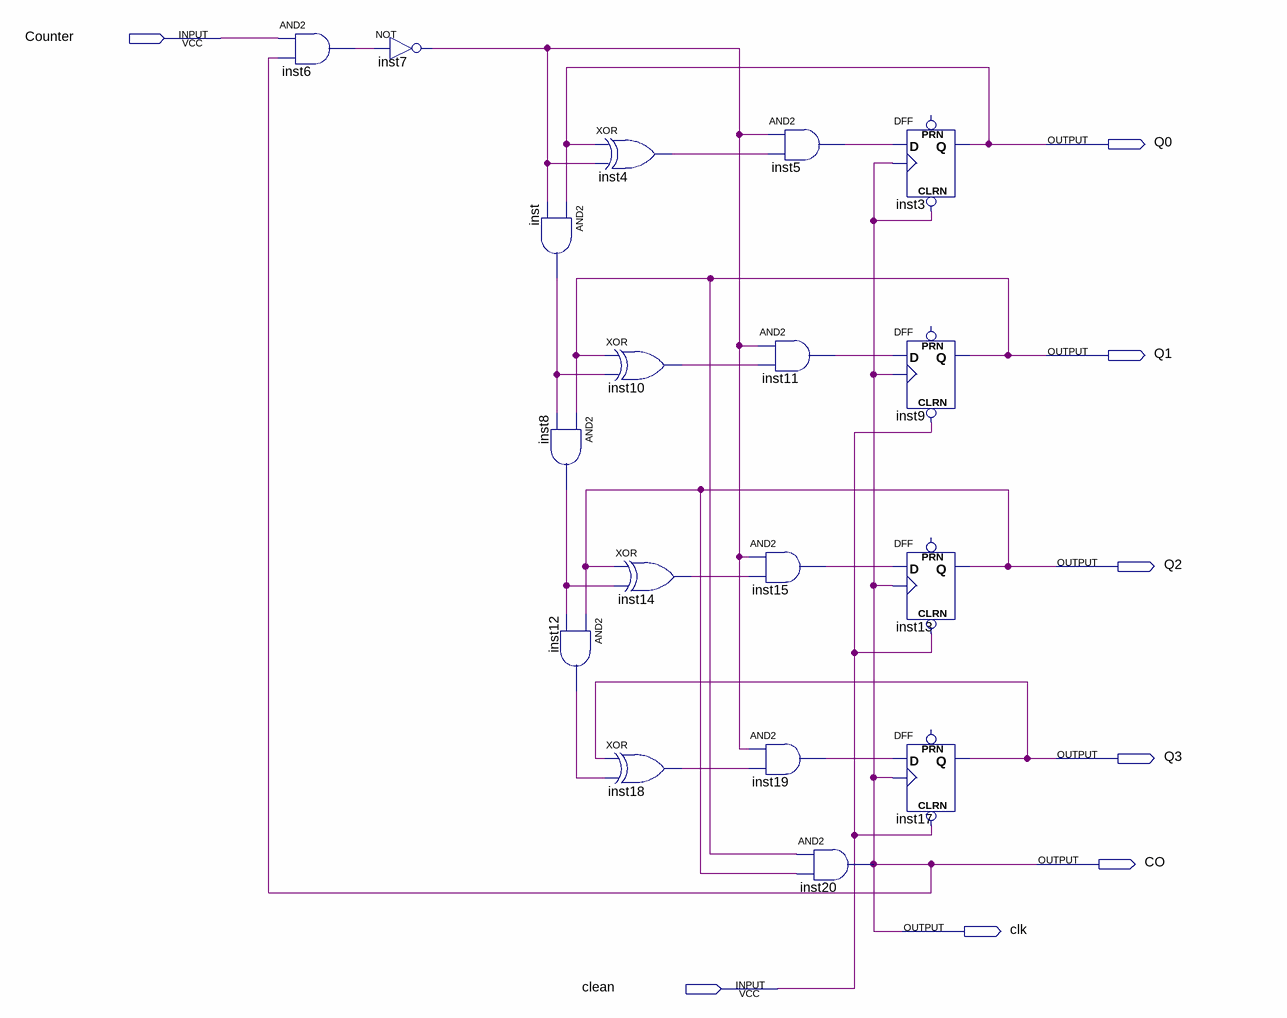
[diagram p0: schematic sheet]
// Quartus schematic digitalclk.bdf as structural Verilog: 18 symbols, 8 pins
module digitalclk (
  input  Counter,
  input  clean,
  output Q0,
  output Q1,
  output Q2,
  output Q3,
  output CO,
  output clk
);

  wire inst4_out, inst5_out, inst6_out, inst7_out, inst8_out, inst10_out, inst11_out, inst12_out, inst14_out,
       inst15_out, inst18_out, inst19_out, inst_out;

  and inst6 (inst6_out, Counter, clk);
  not inst7 (inst7_out, inst6_out);
  and inst (inst_out, Q0, inst7_out);
  and inst8 (inst8_out, Q1, inst_out);
  and inst12 (inst12_out, Q2, inst8_out);
  xor inst4 (inst4_out, Q0, inst7_out);
  xor inst10 (inst10_out, Q1, inst_out);
  xor inst14 (inst14_out, Q2, inst8_out);
  xor inst18 (inst18_out, Q3, inst12_out);
  and inst5 (inst5_out, inst7_out, inst4_out);
  and inst11 (inst11_out, inst7_out, inst10_out);
  and inst15 (inst15_out, inst7_out, inst14_out);
  and inst19 (inst19_out, inst7_out, inst18_out);
  and inst20 (clk, Q1, Q2);
  DFF inst3 (.CLRN(clk), .CLK(clk), .D(inst5_out), .Q(Q0));  // open: PRN
  DFF inst9 (.CLRN(clean), .CLK(clk), .D(inst11_out), .Q(Q1));  // open: PRN
  DFF inst13 (.CLRN(clean), .CLK(clk), .D(inst15_out), .Q(Q2));  // open: PRN
  DFF inst17 (.CLRN(clean), .CLK(clk), .D(inst19_out), .Q(Q3));  // open: PRN

  assign CO = clk;
endmodule
